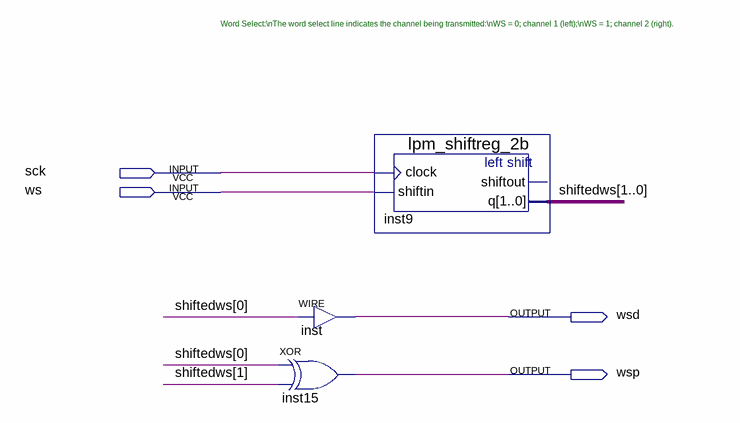
[diagram p0: schematic sheet]
// Quartus schematic i2s_sync.bdf as structural Verilog: 3 symbols, 4 pins
module i2s_sync (
  input  sck,
  input  ws,
  output wsd,
  output wsp
);

  wire [1:0] shiftedws;

  assign wsd = shiftedws[0];  // WIRE inst
  xor inst15 (wsp, shiftedws[0], shiftedws[1]);
  lpm_shiftreg_2b inst9 (.clock(sck), .shiftin(ws), .q(shiftedws));  // open: shiftout

  // Notes on the sheet:
  //   Word Select:\nThe word select line indicates the channel being transmitted:\nWS = 0; channel 1 (left);\nWS = 1; channel 2 (right).
endmodule
